# Altium schematic sheet MICROCONTROLLER.SchDoc
size A4 portrait
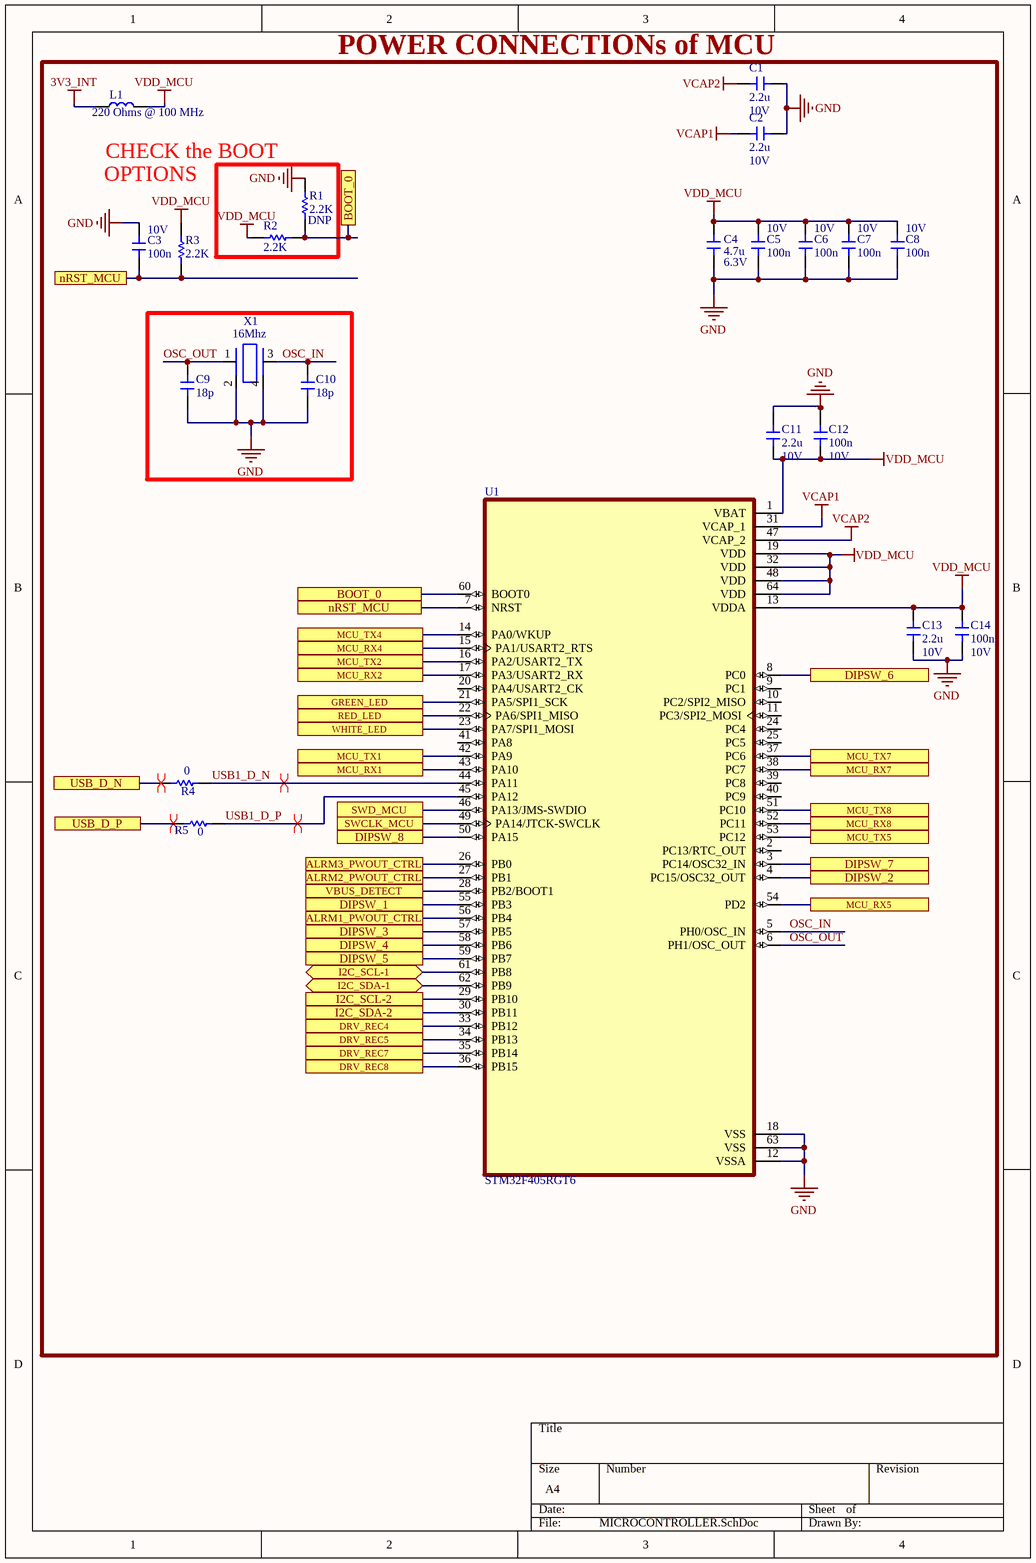
[diagram p0: MICROCONTROLLER.SchDoc]

## Parts
C1  value 2.2u  Voltage: 10V  [CAP_0603_CER]  (hidden comment: CL10A225KP8NNNC)
C2  value 2.2u  Voltage: 10V  [CAP_0603_CER]  (hidden comment: CL10A225KP8NNNC)
C3  value 100n  Voltage: 10V  [CAP_0402_CER]  (hidden comment: CL05B104KP5NNNC)
C4  value 4.7u  Voltage: 6.3V  [CAP_0603_CER]  (hidden comment: CL10A475KP8NNNC)
C5  value 100n  Voltage: 10V  [CAP_0402_CER]  (hidden comment: CL05B104KP5NNNC)
C6  value 100n  Voltage: 10V  [CAP_0402_CER]  (hidden comment: CL05B104KP5NNNC)
C7  value 100n  Voltage: 10V  [CAP_0402_CER]  (hidden comment: CL05B104KP5NNNC)
C8  value 100n  Voltage: 10V  [CAP_0402_CER]  (hidden comment: CL05B104KP5NNNC)
C9  value 18p  [CAP_0402_CER]  (hidden comment: CC0402JRNPO9BN180)
C10  value 18p  [CAP_0402_CER]  (hidden comment: CC0402JRNPO9BN180)
C11  value 2.2u  Voltage: 10V  [CAP_0603_CER]  (hidden comment: CL10A225KP8NNNC)
C12  value 100n  Voltage: 10V  [CAP_0402_CER]  (hidden comment: CL05B104KP5NNNC)
C13  value 2.2u  Voltage: 10V  [CAP_0603_CER]  (hidden comment: CL10A225KP8NNNC)
C14  value 100n  Voltage: 10V  [CAP_0402_CER]  (hidden comment: CL05B104KP5NNNC)
L1  value 220 Ohms @ 100 MHz  [IND_0603_SMD]  (hidden comment: MPZ1608S221ATA00)
R1  value 2.2K  Place: DNP  [RES_0402_SMD]  (hidden comment: RMCF0402JT2K20)
R2  value 2.2K  [RES_0402_SMD]  (hidden comment: RMCF0402JT2K20)
R3  value 2.2K  [RES_0402_SMD]  (hidden comment: RMCF0402JT2K20)
R4  value 0  [RES_0402_SMD]  (hidden comment: RC0402JR-070RL)
R5  value 0  [RES_0402_SMD]  (hidden comment: RC0402JR-070RL)
U1  STM32F405RGT6  [LQFP64-10x10mm]
X1  value 16Mhz  [XTAL-4SMD]  (hidden comment: CF4016M00009T1521005)

## Ports
ALRM1_PWOUT_CTRL, ALRM2_PWOUT_CTRL, ALRM3_PWOUT_CTRL, BOOT_0, DIPSW_1, DIPSW_2, DIPSW_3, DIPSW_4, DIPSW_5, DIPSW_6, DIPSW_7, DIPSW_8, DRV_REC4, DRV_REC5, DRV_REC7, DRV_REC8, GREEN_LED, I2C_SCL-1 (bidir), I2C_SCL-2, I2C_SDA-1 (bidir), I2C_SDA-2, MCU_RX1, MCU_RX2, MCU_RX4, MCU_RX5, MCU_RX7, MCU_RX8, MCU_TX1, MCU_TX2, MCU_TX4, MCU_TX5, MCU_TX7, MCU_TX8, nRST_MCU, RED_LED, SWCLK_MCU, SWD_MCU, USB_D_N, USB_D_P, VBUS_DETECT, WHITE_LED

## Nets
3V3_INT: L1.1
GND: C1.1 C2.1 C3.1 C4.1 C5.2 C6.2 C7.2 C8.2 C9.2 C10.2 C11.2 C12.1 C13.1 C14.2 R1.2 U1.12(VSSA) U1.18(VSS) U1.63(VSS) X1.2 X1.4
VCAP1: C2.2 U1.31(VCAP_1)
VCAP2: C1.2 U1.47(VCAP_2)
VDD_MCU: C4.2 C5.1 C6.1 C7.1 C8.1 C11.1 C12.2 C13.2 C14.1 L1.2 R2.2 R3.1 U1.1(VBAT) U1.13(VDDA) U1.19(VDD) U1.32(VDD) U1.48(VDD) U1.64(VDD)
ALRM1_PWOUT_CTRL: U1.56(PB4) ; port ALRM1_PWOUT_CTRL
ALRM2_PWOUT_CTRL: U1.27(PB1) ; port ALRM2_PWOUT_CTRL
ALRM3_PWOUT_CTRL: U1.26(PB0) ; port ALRM3_PWOUT_CTRL
BOOT_0: R1.1 R2.1 U1.60(BOOT0) ; port BOOT_0
DIPSW_1: U1.55(PB3) ; port DIPSW_1
DIPSW_2: U1.4(PC15/OSC32_OUT) ; port DIPSW_2
DIPSW_3: U1.57(PB5) ; port DIPSW_3
DIPSW_4: U1.58(PB6) ; port DIPSW_4
DIPSW_5: U1.59(PB7) ; port DIPSW_5
DIPSW_6: U1.8(PC0) ; port DIPSW_6
DIPSW_7: U1.3(PC14/OSC32_IN) ; port DIPSW_7
DIPSW_8: U1.50(PA15) ; port DIPSW_8
DRV_REC4: U1.33(PB12) ; port DRV_REC4
DRV_REC5: U1.34(PB13) ; port DRV_REC5
DRV_REC7: U1.35(PB14) ; port DRV_REC7
DRV_REC8: U1.36(PB15) ; port DRV_REC8
GREEN_LED: U1.21(PA5/SPI1_SCK) ; port GREEN_LED
I2C_SCL-1: U1.61(PB8) ; port I2C_SCL-1
I2C_SCL-2: U1.29(PB10) ; port I2C_SCL-2
I2C_SDA-1: U1.62(PB9) ; port I2C_SDA-1
I2C_SDA-2: U1.30(PB11) ; port I2C_SDA-2
MCU_RX1: U1.43(PA10) ; port MCU_RX1
MCU_RX2: U1.17(PA3/USART2_RX) ; port MCU_RX2
MCU_RX4: U1.15(PA1/USART2_RTS) ; port MCU_RX4
MCU_RX5: U1.54(PD2) ; port MCU_RX5
MCU_RX7: U1.38(PC7) ; port MCU_RX7
MCU_RX8: U1.52(PC11) ; port MCU_RX8
MCU_TX1: U1.42(PA9) ; port MCU_TX1
MCU_TX2: U1.16(PA2/USART2_TX) ; port MCU_TX2
MCU_TX4: U1.14(PA0/WKUP) ; port MCU_TX4
MCU_TX5: U1.53(PC12) ; port MCU_TX5
MCU_TX7: U1.37(PC6) ; port MCU_TX7
MCU_TX8: U1.51(PC10) ; port MCU_TX8
nRST_MCU: C3.2 R3.2 U1.7(NRST) ; port nRST_MCU
OSC_IN: C10.1 U1.5(PH0/OSC_IN) X1.3
OSC_OUT: C9.1 U1.6(PH1/OSC_OUT) X1.1
RED_LED: U1.22(PA6/SPI1_MISO) ; port RED_LED
SWCLK_MCU: U1.49(PA14/JTCK-SWCLK) ; port SWCLK_MCU
SWD_MCU: U1.46(PA13/JMS-SWDIO) ; port SWD_MCU
USB1_D_N: R4.2 U1.44(PA11)
USB1_D_P: R5.2 U1.45(PA12)
USB_D_N: R4.1 ; port USB_D_N
USB_D_P: R5.1 ; port USB_D_P
VBUS_DETECT: U1.28(PB2/BOOT1) ; port VBUS_DETECT
WHITE_LED: U1.23(PA7/SPI1_MOSI) ; port WHITE_LED

Not connected (* = marked no-connect by the designer): U1 2(PC13/RTC_OUT) 9(PC1) 10(PC2/SPI2_MISO) 11(PC3/SPI2_MOSI) 20(PA4/USART2_CK) 24(PC4) 25(PC5) 39(PC8) 40(PC9) 41(PA8)

## Layout directives
differential pair: USB1_D_N, USB1_D_P, USB_D_N, USB_D_P

## Notes on the sheet
- POWER CONNECTIONs of MCU
- CHECK the BOOT
- OPTIONS

## Library data of the parts
C1-C14 = CAP_GEN_CER: Generic; Place: P; Power: *; Tolerance: *; Operating Temp.: *
  C1 C2 C11 C13: Part Number: CL10A225KP8NNNC; Package: *
  C3 C5-C8 C12 C14: Part Number: CL05B104KP5NNNC; Package: *
  C4: Part Number: CL10A475KP8NNNC; Package: *
  C9 C10: Part Number: CC0402JRNPO9BN180; Package: 0402; Voltage: *
L1 = IND_GEN_SMD: Generic SMD IND/BEAD; Place: P; Part Number: MPZ1608S221ATA00; Power: *; Package: *; Tolerance: *; Voltage: *; Operating Temp.: *
R1 = RES_GEN_SMD: Generic Chip Res; Package: *; Part Number: RMCF0402JT2K20; Power: *; Tolerance: *; Voltage: *; Operating Temp.: *
R2-R5 = RES_GEN_SMD: Generic Chip Res; Place: P; Package: *; Power: *; Tolerance: *; Voltage: *; Operating Temp.: *
  R2 R3: Part Number: RMCF0402JT2K20
  R4 R5: Part Number: RC0402JR-070RL
U1 = STM32F405RGT6: High-performance foundation line, ARM Cortex-M4 core with DSP and FPU, 1 Mbyte Flash, 168 MHz CPU, ART Accelerator; Value: *; Package: None; MP: STM32F405RGT6; Price: None; Availability: Unavailable
X1 = XTAL-4PINs: 16 MHz ±10ppm Crystal 9pF 40 Ohms 4-SMD, No Lead; Manufacturer: Hefei Jingweite Electronics Co., Ltd.; Place: POP; Voltage: N/A; Tolerance: ±10ppm; Power: N/A; Part Number: CF4016M00009T1521005; Operating Temp.: -40°C ~ 125°C